# Altium schematic sheet Sheet2.SchDoc: DDR3L
size A4; SheetNumber: 2; SheetTotal: 6
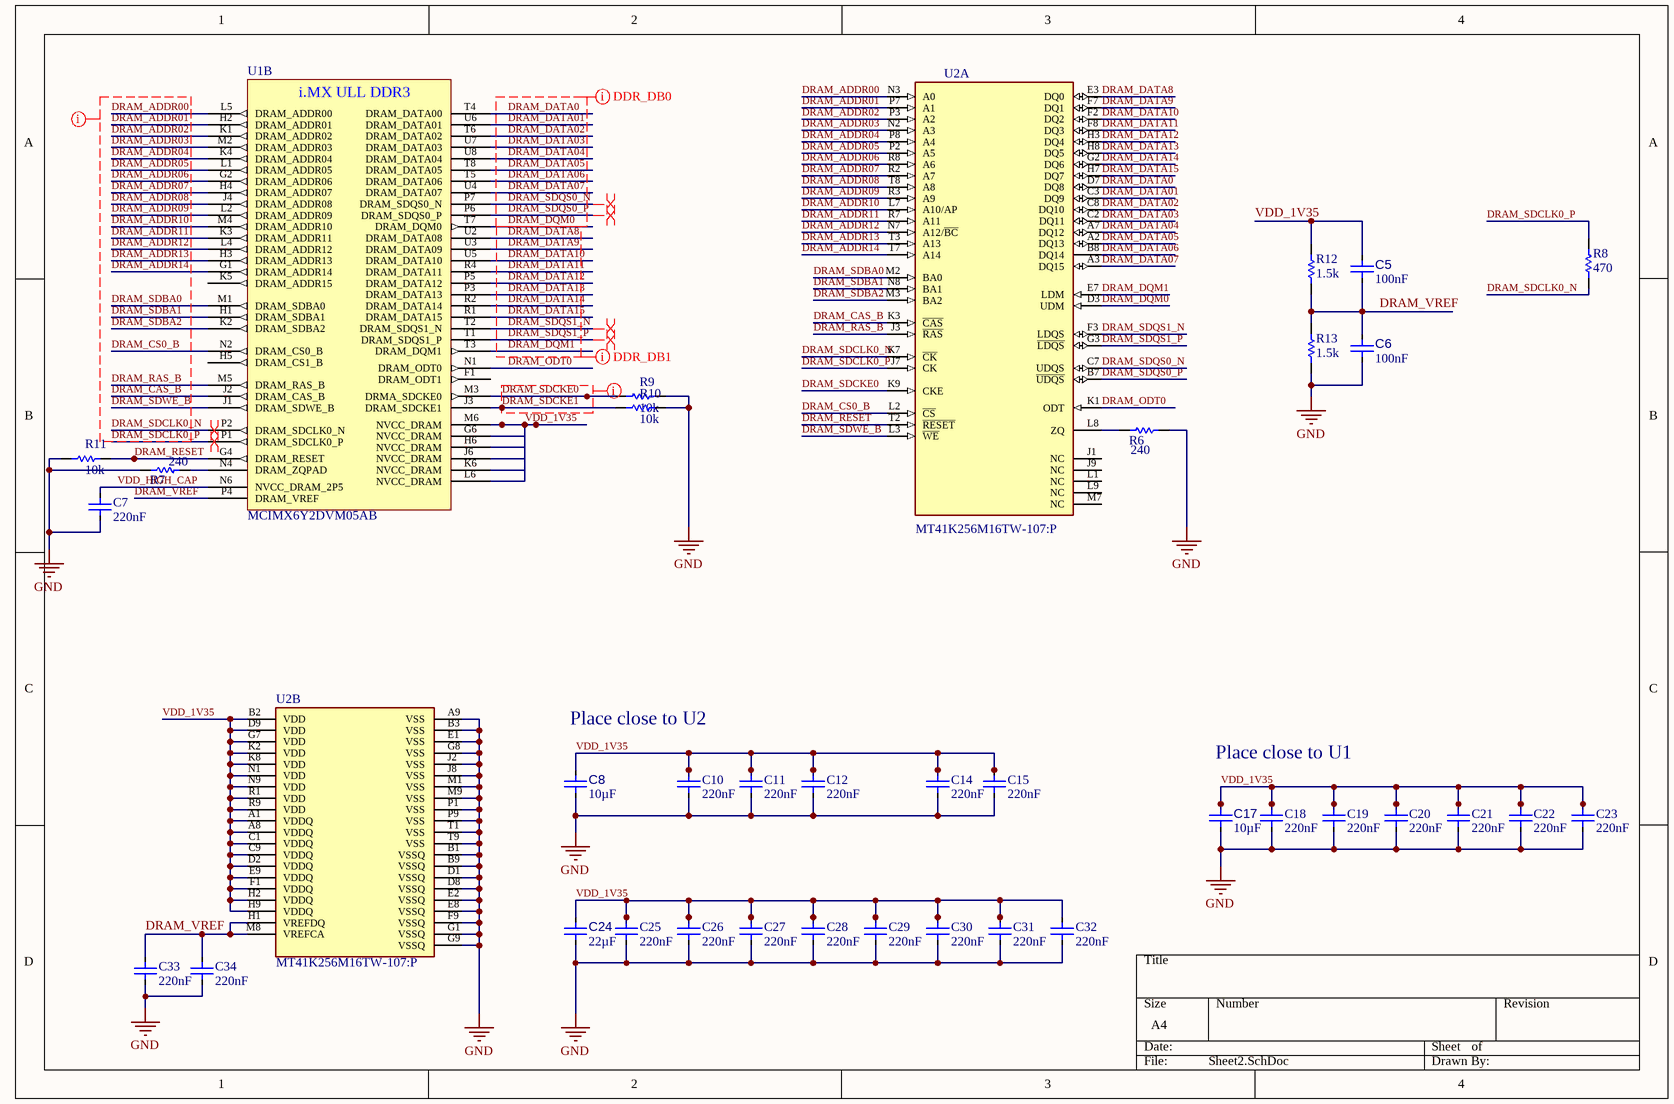
[diagram p0: Sheet2.SchDoc]

## Parts
C5  value 100nF  [0402-SMD-CAP]  (hidden comment: EMF105B7104MVHF)
C6  value 100nF  [0402-SMD-CAP]  (hidden comment: EMF105B7104MVHF)
C7  value 220nF  [0402-SMD-CAP]  (hidden comment: 0402ZD224KAT2A)
C8  value 10µF  [0603-SMD-CAP]  (hidden comment: 0603ZD106KAT2A)
C10  value 220nF  [0402-SMD-CAP]  (hidden comment: 0402ZD224KAT2A)
C11  value 220nF  [0402-SMD-CAP]  (hidden comment: 0402ZD224KAT2A)
C12  value 220nF  [0402-SMD-CAP]  (hidden comment: 0402ZD224KAT2A)
C14  value 220nF  [0402-SMD-CAP]  (hidden comment: 0402ZD224KAT2A)
C15  value 220nF  [0402-SMD-CAP]  (hidden comment: 0402ZD224KAT2A)
C17  value 10µF  [0603-SMD-CAP]  (hidden comment: 0603ZD106KAT2A)
C18  value 220nF  [0402-SMD-CAP]  (hidden comment: 0402ZD224KAT2A)
C19  value 220nF  [0402-SMD-CAP]  (hidden comment: 0402ZD224KAT2A)
C20  value 220nF  [0402-SMD-CAP]  (hidden comment: 0402ZD224KAT2A)
C21  value 220nF  [0402-SMD-CAP]  (hidden comment: 0402ZD224KAT2A)
C22  value 220nF  [0402-SMD-CAP]  (hidden comment: 0402ZD224KAT2A)
C23  value 220nF  [0402-SMD-CAP]  (hidden comment: 0402ZD224KAT2A)
C24  value 22µF  [0805-SMD-CAP]  (hidden comment: CL21A226MOQNNNE)
C25  value 220nF  [0402-SMD-CAP]  (hidden comment: 0402ZD224KAT2A)
C26  value 220nF  [0402-SMD-CAP]  (hidden comment: 0402ZD224KAT2A)
C27  value 220nF  [0402-SMD-CAP]  (hidden comment: 0402ZD224KAT2A)
C28  value 220nF  [0402-SMD-CAP]  (hidden comment: 0402ZD224KAT2A)
C29  value 220nF  [0402-SMD-CAP]  (hidden comment: 0402ZD224KAT2A)
C30  value 220nF  [0402-SMD-CAP]  (hidden comment: 0402ZD224KAT2A)
C31  value 220nF  [0402-SMD-CAP]  (hidden comment: 0402ZD224KAT2A)
C32  value 220nF  [0402-SMD-CAP]  (hidden comment: 0402ZD224KAT2A)
C33  value 220nF  [0402-SMD-CAP]  (hidden comment: 0402ZD224KAT2A)
C34  value 220nF  [0402-SMD-CAP]  (hidden comment: 0402ZD224KAT2A)
R6  value 240  [0402_SMD_RES]  (hidden comment: RC0402FR-07240RL)
R7  value 240  [0402_SMD_RES]  (hidden comment: RC0402FR-07240RL)
R8  value 470  [0402_SMD_RES]  (hidden comment: CRCW0402470RFKED)
R9  value 10k  [0402_SMD_RES]  (hidden comment: CRCW040210K0FKTD)
R10  value 10k  [0402_SMD_RES]  (hidden comment: CRCW040210K0FKTD)
R11  value 10k  [0402_SMD_RES]  (hidden comment: CRCW040210K0FKTD)
R12  value 1.5k  [0402_SMD_RES]  (hidden comment: ERJ-2RKF1501X)
R13  value 1.5k  [0402_SMD_RES]  (hidden comment: ERJ-2RKF1501X)
U1  MCIMX6Y2DVM05AB  [BGA100P9X9-81A]  (part B of 11)
U2  MT41K256M16TW-107:P  [FP-TW-IPC_B]  (parts A,B of 2)

## Nets
GND: C6.1 C7.1 C8.1 C10.1 C11.1 C12.1 C14.1 C15.1 C17.1 C18.1 C19.1 C20.1 C21.1 C22.1 C23.1 C24.1 C25.1 C26.1 C27.1 C28.1 C29.1 C30.1 C31.1 C32.1 C33.1 C34.1 R6.2 R7.1 R9.2 R10.2 R11.1 R13.1 U2.A9(VSS) U2.B1(VSSQ) U2.B3(VSS) U2.B9(VSSQ) U2.D1(VSSQ) U2.D8(VSSQ) U2.E1(VSS) U2.E2(VSSQ) U2.E8(VSSQ) U2.F9(VSSQ) U2.G1(VSSQ) U2.G8(VSS) U2.G9(VSSQ) U2.J2(VSS) U2.J8(VSS) U2.M1(VSS) U2.M9(VSS) U2.P1(VSS) U2.P9(VSS) U2.T1(VSS) U2.T9(VSS)
DRAM_ADDR00: U1.L5(DRAM_ADDR00) U2.N3(A0)
DRAM_ADDR01: U1.H2(DRAM_ADDR01) U2.P7(A1)
DRAM_ADDR02: U1.K1(DRAM_ADDR02) U2.P3(A2)
DRAM_ADDR03: U1.M2(DRAM_ADDR03) U2.N2(A3)
DRAM_ADDR04: U1.K4(DRAM_ADDR04) U2.P8(A4)
DRAM_ADDR05: U1.L1(DRAM_ADDR05) U2.P2(A5)
DRAM_ADDR06: U1.G2(DRAM_ADDR06) U2.R8(A6)
DRAM_ADDR07: U1.H4(DRAM_ADDR07) U2.R2(A7)
DRAM_ADDR08: U1.J4(DRAM_ADDR08) U2.T8(A8)
DRAM_ADDR09: U1.L2(DRAM_ADDR09) U2.R3(A9)
DRAM_ADDR10: U1.M4(DRAM_ADDR10) U2.L7(A10/AP)
DRAM_ADDR11: U1.K3(DRAM_ADDR11) U2.R7(A11)
DRAM_ADDR12: U1.L4(DRAM_ADDR12) U2.N7(A12/~{BC})
DRAM_ADDR13: U1.H3(DRAM_ADDR13) U2.T3(A13)
DRAM_ADDR14: U1.G1(DRAM_ADDR14) U2.T7(A14)
DRAM_CAS_B: U1.J2(DRAM_CAS_B) U2.K3(~{CAS})
DRAM_CS0_B: U1.N2(DRAM_CS0_B) U2.L2(~{CS})
DRAM_DATA0: U1.T4(DRAM_DATA00) U2.D7(DQ8)
DRAM_DATA01: U1.U6(DRAM_DATA01) U2.C3(DQ9)
DRAM_DATA02: U1.T6(DRAM_DATA02) U2.C8(DQ10)
DRAM_DATA03: U1.U7(DRAM_DATA03) U2.C2(DQ11)
DRAM_DATA04: U1.U8(DRAM_DATA04) U2.A7(DQ12)
DRAM_DATA05: U1.T8(DRAM_DATA05) U2.A2(DQ13)
DRAM_DATA06: U1.T5(DRAM_DATA06) U2.B8(DQ14)
DRAM_DATA07: U1.U4(DRAM_DATA07) U2.A3(DQ15)
DRAM_DATA8: U1.U2(DRAM_DATA08) U2.E3(DQ0)
DRAM_DATA9: U1.U3(DRAM_DATA09) U2.F7(DQ1)
DRAM_DATA10: U1.U5(DRAM_DATA10) U2.F2(DQ2)
DRAM_DATA11: U1.R4(DRAM_DATA11) U2.F8(DQ3)
DRAM_DATA12: U1.P5(DRAM_DATA12) U2.H3(DQ4)
DRAM_DATA13: U1.P3(DRAM_DATA13) U2.H8(DQ5)
DRAM_DATA14: U1.R2(DRAM_DATA14) U2.G2(DQ6)
DRAM_DATA15: U1.R1(DRAM_DATA15) U2.H7(DQ7)
DRAM_DQM0: U1.T7(DRAM_DQM0) U2.D3(UDM)
DRAM_DQM1: U1.T3(DRAM_DQM1) U2.E7(LDM)
DRAM_ODT0: U1.N1(DRAM_ODT0) U2.K1(ODT)
DRAM_RAS_B: U1.M5(DRAM_RAS_B) U2.J3(~{RAS})
DRAM_RESET: R11.2 U1.G4(DRAM_RESET) U2.T2(~{RESET})
DRAM_SDBA0: U1.M1(DRAM_SDBA0) U2.M2(BA0)
DRAM_SDBA1: U1.H1(DRAM_SDBA1) U2.N8(BA1)
DRAM_SDBA2: U1.K2(DRAM_SDBA2) U2.M3(BA2)
DRAM_SDCKE0: R9.1 U1.M3(DRMA_SDCKE0) U2.K9(CKE)
DRAM_SDCKE1: R10.1 U1.J3(DRAM_SDCKE1)
DRAM_SDCLK0_N: R8.1 U1.P2(DRAM_SDCLK0_N) U2.K7(~{CK})
DRAM_SDCLK0_P: R8.2 U1.P1(DRAM_SDCLK0_P) U2.J7(CK)
DRAM_SDQS0_N: U1.P7(DRAM_SDQS0_N) U2.C7(UDQS)
DRAM_SDQS0_P: U1.P6(DRAM_SDQS0_P) U2.B7(~{UDQS})
DRAM_SDQS1_N: U1.T2(DRAM_SDQS1_N) U2.F3(LDQS)
DRAM_SDQS1_P: U1.T1(DRAM_SDQS1_P) U2.G3(~{LDQS})
DRAM_SDWE_B: U1.J1(DRAM_SDWE_B) U2.L3(~{WE})
DRAM_VREF: C5.1 C6.2 C33.2 C34.2 R12.1 R13.2 U1.P4(DRAM_VREF) U2.H1(VREFDQ) U2.M8(VREFCA)
VDD_1V35: C5.2 C8.2 C10.2 C11.2 C12.2 C14.2 C15.2 C17.2 C18.2 C19.2 C20.2 C21.2 C22.2 C23.2 C24.2 C25.2 C26.2 C27.2 C28.2 C29.2 C30.2 C31.2 C32.2 R12.2 U1.G6(NVCC_DRAM) U1.H6(NVCC_DRAM) U1.J6(NVCC_DRAM) U1.K6(NVCC_DRAM) U1.L6(NVCC_DRAM) U1.M6(NVCC_DRAM) U2.A1(VDDQ) U2.A8(VDDQ) U2.B2(VDD) U2.C1(VDDQ) U2.C9(VDDQ) U2.D2(VDDQ) U2.D9(VDD) U2.E9(VDDQ) U2.F1(VDDQ) U2.G7(VDD) U2.H2(VDDQ) U2.H9(VDDQ) U2.K2(VDD) U2.K8(VDD) U2.N1(VDD) U2.N9(VDD) U2.R1(VDD) U2.R9(VDD)
VDD_HIGH_CAP: C7.2 U1.N6(NVCC_DRAM_2P5)
NetR6_1: R6.1 U2.L8(ZQ)
NetR7_2: R7.2 U1.N4(DRAM_ZQPAD)

Not connected (* = marked no-connect by the designer): U1 F1(DRAM_ODT1) H5(DRAM_CS1_B) K5(DRAM_ADDR15); U2 J1(NC) J9(NC) L1(NC) L9(NC) M7(NC)

## Layout directives
differential pair: DRAM_SDCLK0_N, DRAM_SDCLK0_P, DRAM_SDQS0_N, DRAM_SDQS0_P, DRAM_SDQS1_N, DRAM_SDQS1_P
net class DDR_ADDR: DRAM_ADDR00, DRAM_ADDR01, DRAM_ADDR02, DRAM_ADDR03, DRAM_ADDR04, DRAM_ADDR05, DRAM_ADDR06, DRAM_ADDR07, DRAM_ADDR08, DRAM_ADDR09, DRAM_ADDR10, DRAM_ADDR11, DRAM_ADDR12, DRAM_ADDR13, DRAM_ADDR14, DRAM_CAS_B, DRAM_CS0_B, DRAM_RAS_B, DRAM_SDBA0, DRAM_SDBA1, DRAM_SDBA2, DRAM_SDCKE0, DRAM_SDCLK0_N, DRAM_SDCLK0_P, DRAM_SDWE_B
net class DDR_DB0: DRAM_DATA0, DRAM_DATA01, DRAM_DATA02, DRAM_DATA03, DRAM_DATA04, DRAM_DATA05, DRAM_DATA06, DRAM_DATA07, DRAM_SDQS0_N, DRAM_SDQS0_P
net class DDR_DB1: DRAM_DATA8, DRAM_DATA9, DRAM_DATA10, DRAM_DATA11, DRAM_DATA12, DRAM_DATA13, DRAM_DATA14, DRAM_DATA15, DRAM_DQM0, DRAM_DQM1, DRAM_SDQS1_N, DRAM_SDQS1_P

## Notes on the sheet
- Place close to U2
- Place close to U1
- (in symbol CMP-003-000001-14, part B) i.MX ULL DDR3

## Library data of the parts
C5 C6 = CMP-001-00001-14: Chip Capacitor, 0.1 uF, +/- 5%, 16 V, 0402 (1005 Metric); Capacitor Type: Ceramic; Voltage Rating: 16V; Case/Package: 0402; Max Operating Temperature: 125°C; Mounting Technology: SM; RoHS Compliant: True; Pins: 2; Min Operating Temperature: -55°C; Tolerance: 5%; Mfr. Part No.: EMF105B7104MVHF
C7 C10-C12 C14 C15 C18-C23 C25-C34 = CMP-001-00057-16: Chip Capacitor, 220nF +/-20%, 10V, 0402, Thickness 0.6 mm; Tolerance: 10%; Mounting Technology: SMT; Max Operating Temperature: 85°C; Min Operating Temperature: -55°C; Pins: 2; Voltage Rating: 10V; Case/Package: 0402; Mfr. Part No.: 0402ZD224KAT2A
C8 C17 = CMP-001-00075-11: Chip Capacitor, 10µF +/-20%, 10V, 0603, Thickness 1 mm; Tolerance: 10%; Pins: 2; Max Operating Temperature: 85°C; Case/Package: 0603; Voltage Rating: 10V; Mounting Technology: SMT; Min Operating Temperature: -55°C; Mfr. Part No.: 0603ZD106KAT2A
C24 = CMP-001-00081-10: Chip Capacitor, 22µF +/-40%, 16V, 0805, Thickness 1.45 mm; Tolerance: 5%; Case/Package: 0805; Min Operating Temperature: -55°C; Pins: 2; Voltage Rating: 16V; Max Operating Temperature: 85°C; Mounting Technology: SMT; Mfr. Part No.: CL21A226MOQNNNE
R6 R7 = CMP-009-00180-9: Res Thick Film 0402 240 Ohm 1% 0.063W(1/16W) ±100ppm/C Molded SMD Paper T/R; Voltage Rating: 50V; Max Power Dissipation: 63mW; Resistance: 240R; Temperature Coefficient: 100ppm/°C; Resistor Type: Thick Film; REACH SVHC: Unknown; Width: 0.02inch; Height: 0.016inch; Series: RC; Case Code (Imperial): 0402; Features: Moisture Resistant; Termination: SMD/SMT; Military Standard: Not; Resistance Tolerance: 1%; Depth: 0.5mm; RoHS Compliant: Yes; Package Quantity: 1; Case Code (Metric): 1005; Lead Free: Lead Free; Power Rating: 63mW; Size Code: 0402; Packaging: Tape and Reel; Case/Package: 0402; Construction: Rectangular; Voltage Rating (DC): 50V; Tolerance: 1%; Max Operating Temperature: 155°C; Number of Terminations: 2; Min Operating Temperature: -55°C; Length: 1mm
R8 = CMP-009-00178-9: RES SMD 470 OHM 1% 1/16W 0402; Power: 2.66W; Resistance: 470; Case/Package: 0402; Tolerance: 1%
R9-R11 = CMP-009-00149-9: Chip Resistor, 10 kOhms, +/-1 %, 63 mW, -55 to 125 degC, 0402; Power: 63mW; Tolerance: 1%; Pins: 2; Max Operating Temperature: 155°C; Min Operating Temperature: -55°C; Case/Package: 0402; Mfr. Part No.: CRCW040210K0FKTD
R12 R13 = CMP-009-00181-8: PANASONIC - ERJ2RKF1501X - RES, 1K5, 1%, 0.1W, 0402, THICK FILM; Max Power Dissipation: 100mW; Voltage Rating: 50V; Temperature Coefficient: 100ppm/°C; Packaging: Tape and Reel; Height: 0.35mm; Case Code (Metric): 1005; Max Operating Temperature: 155°C; Power Rating: 100mW; Resistor Type: Thick Film; Contact Plating: Tin; Case/Package: 0402; Width: 0.02inch; Size Code: 0402; Length: 1mm; Min Operating Temperature: -55°C; Tolerance: 1%; RoHS Compliant: Yes; Resistance: 1.5k; Package Quantity: 1; Resistance Tolerance: 1%; Mount: Surface Mount; Depth: 0.5mm; Military Standard: Not; Termination: SMD/SMT; REACH SVHC: No SVHC; Construction: Rectangular; Features: Automotive AEC-Q200; Radiation Hardening: No; Lead Free: Lead Free; Technology: THICK FILM; Voltage Rating (DC): 50V; Number of Terminations: 2; Number of Pins: 2; Case Code (Imperial): 0402; Series: ERJ
U1 = CMP-003-000001-14: Package: MAPBGA; Design Item ID: MCIMX6Y2DVM05AB; Mfr. Part Nr.: MCIMX6Y2DVM05AB; Source: Schlib1.SchLib
U2 = CMP-019-00049-6: DRAM Chip DDR3L SDRAM 4G-Bit 256Mx16 1.35V 96 FBGA